# EasyEDA Pro project ProProject_Adapter_1.0.epro

# Schematic Schematic1
Create Date: 2024-11-24; Page Name: P1; Project Name: adc_commutation_pcb; Schematic Name: Schematic1; Update Date: 2025-01-06; Company: EasyEDA.com; Drawn: EasyEDA; Page Size: A4; Part Number: JLCPCB-002; Reviewed: EasyEDA; Version: V0.1
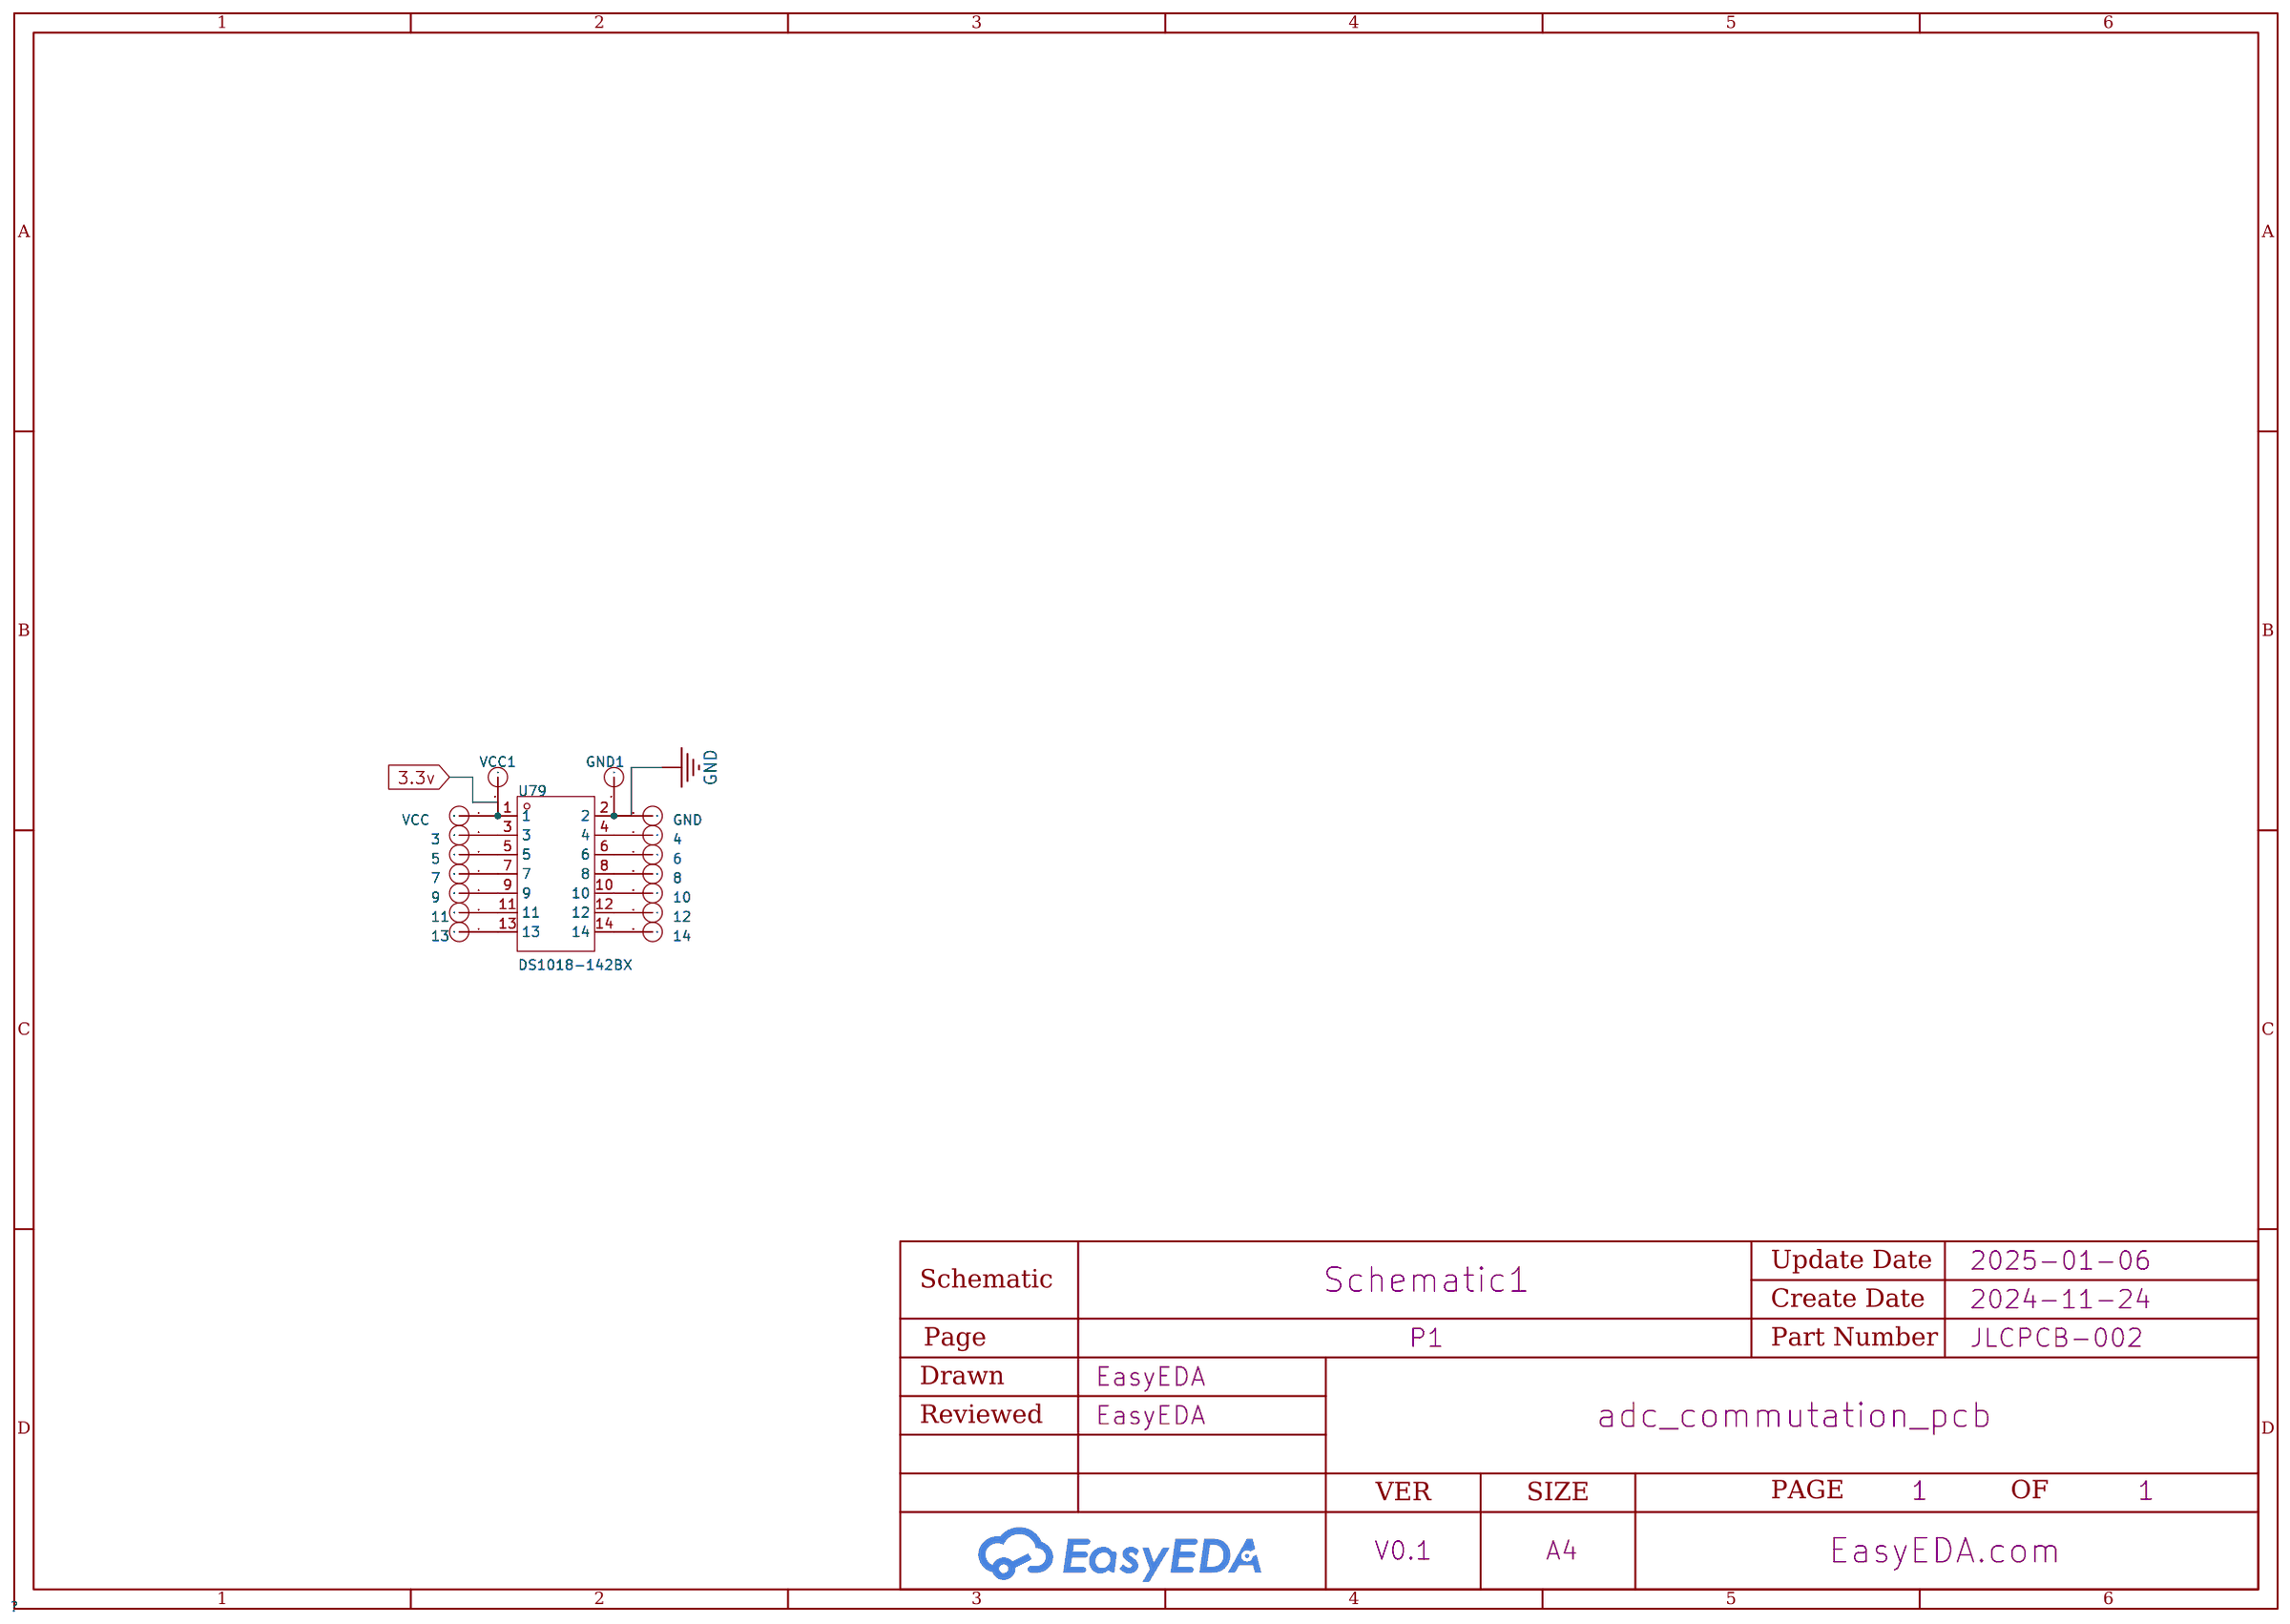
[diagram p0: schematic sheet]

## Parts
3  -  [robust_pin]
4  -  [robust_pin]
5  -  [robust_pin]
6  -  [robust_pin]
7  -  [robust_pin]
8  -  [robust_pin]
9  -  [robust_pin]
10  -  [robust_pin]
11  -  [robust_pin]
12  -  [robust_pin]
13  -  [robust_pin]
14  -  [robust_pin]
GND  -  [robust_pin]
GND1  -  [robust_pin]
U79  DS1018-142BX  [HDR-TH_14P-P2.54_CONNFLY_DS1018-142BX]
VCC  -  [robust_pin]
VCC1  -  [robust_pin]

## Library data of the parts
3-14 GND GND1 VCC VCC1 = robust_pin
U79 = DS1018-142BX: Pitch:2.54mm Structure:2x7P Number of Rows:2 Pin Number in each Row:7; LCSC Part Name: 2.54mm 2x7P 排数:2 每排P数:7; Supplier Part: C7502660; Manufacturer: CONNFLY; Supplier Footprint: 插件; JLCPCB Part Class: Extended Part; Datasheet: https://atta.szlcsc.com/upload/public/pdf/source/20230825/6018DB9854604917DD28F03647840F16.pdf; Supplier: LCSC; Pitch: 2.54mm; Structure: 2x7P; Number of Rows: 2; Pin Number in each Row: 7

## Nets
3.3v: U79.1 VCC.1 VCC1.1
GND: GND.1 GND1.1 U79.2
$1N1435: 3.1 U79.3
$1N1456: 4.1 U79.4
$1N1477: 6.1 U79.6
$1N1498: 8.1 U79.8
$1N1519: 10.1 U79.10
$1N1540: 12.1 U79.12
$1N1561: 14.1 U79.14
$1N1582: 5.1 U79.5
$1N1603: 7.1 U79.7
$1N1624: 9.1 U79.9
$1N1645: 11.1 U79.11
$1N1666: 13.1 U79.13

# Board PCB1
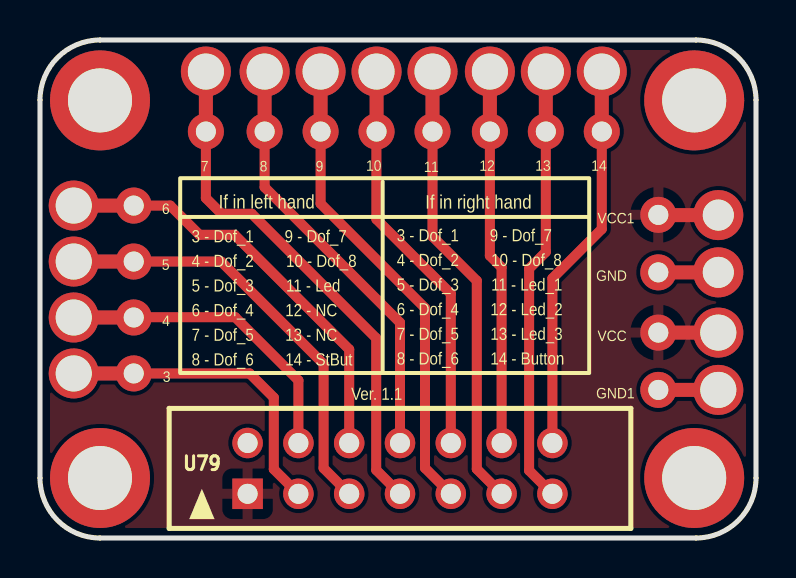
[diagram p1: board, top side]
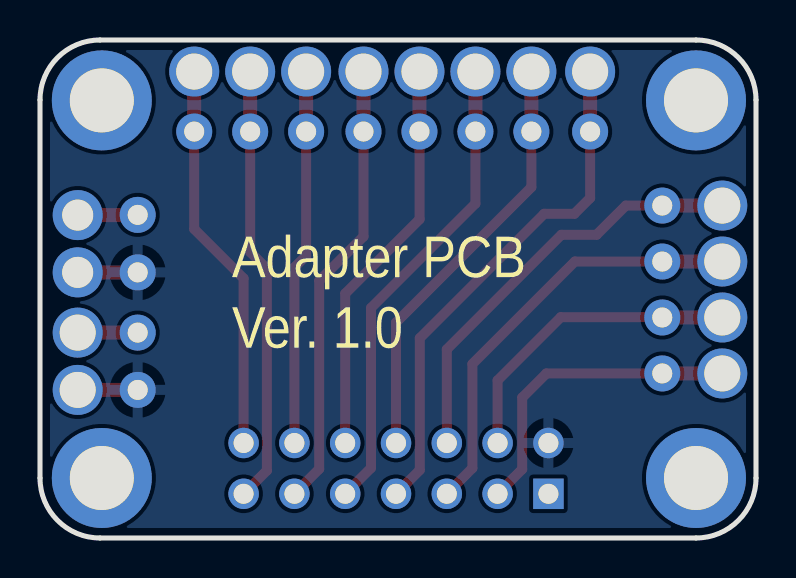
[diagram p2: board, bottom side, seen from below]

Outline 35.8 x 24.9 mm; copper layers: Top Layer, Bottom Layer. Coordinates in mm from the lower left corner of the outline.
Outline path: 0,21.9 0,3 arc(0.88,0.88) 3,0 32.8,0 arc(34.92,0.88) 35.8,3 35.8,21.9 arc(34.92,24.02) 32.8,24.9 3,24.9 arc(0.88,24.02) 0,21.9
Stack: Top Layer 0.035mm - / Dielectric1 1.51mm FR4 er 4.5 / Bottom Layer 0.035mm -

## Design rules (mm)
template: JLCPCB Capability(Two Layers Board)
spacing copperThickness1oz (default): track to track 0.102, other pairs 0.152 to 0.3
spacing copperThickness2oz: track to track 0.203, other pairs 0.152 to 0.3
track width copperThickness1oz (default): min 0.127, default 0.254, max 2.54
track width copperThickness2oz: min 0.203, default 0.254, max 2.54
differential pair differentialPair (default): width min 0.127, default 0.254, max 2.54; gap min 0.152, default 0.152
via viaSize (default): diameter min 0.5, default 0.61, max 10; hole min 0.3, default 0.305, max 6.3

## Placement (name value [footprint] x y rotation side)
3  -  [robust_pin]  4.69 8.23 90 top
4  -  [robust_pin]  4.69 11.03 90 top
5  -  [robust_pin]  4.69 13.82 90 top
6  -  [robust_pin]  4.69 16.62 90 top
7  -  [robust_pin]  8.29 20.32 0 top
8  -  [robust_pin]  11.23 20.32 0 top
9  -  [robust_pin]  14.03 20.32 0 top
10  -  [robust_pin]  16.83 20.32 0 top
11  -  [robust_pin]  19.63 20.32 0 top
12  -  [robust_pin]  22.49 20.32 0 top
13  -  [robust_pin]  25.29 20.32 0 top
14  -  [robust_pin]  28.09 20.32 0 top
GND  -  [robust_pin#2]  30.92 13.28 270 top
GND1  -  [robust_pin]  30.92 7.41 270 top
NOREF  -  [Pad_e4]  32.71 21.88 0 top
NOREF#2  -  [Pad_e78]  3 3 0 top
NOREF#3  -  [Pad_e77]  3 21.88 0 top
NOREF#4  -  [Pad_e75]  32.71 3 0 top
U79  DS1018-142BX  [hdr-th_14p-p2.54_connfly_ds1018-142bx]  18 3.48 0 top
VCC  -  [robust_pin]  30.92 10.27 270 top
VCC1  -  [robust_pin#2]  30.92 16.16 269.8 top

## Footprints (pads in the part's own frame, mm; a bottom-side part is the same pattern mirrored in y, then rotated)
hdr-th_14p-p2.54_connfly_ds1018-142bx
  rect 1.524x1.524 hole 1: 1(-7.62,-1.27)
  round 1.524 hole 1: 2(-7.62,1.27) 3(-5.08,-1.27) 4(-5.08,1.27) 5(-2.54,-1.27) 6(-2.54,1.27) 7(0,-1.27) 8(0,1.27) 9(2.54,-1.27) 10(2.54,1.27) 11(5.08,-1.27) 12(5.08,1.27) 13(7.62,-1.27) 14(7.62,1.27)
Pad_e4
  round 5 hole 3.2: 2(0,0)
Pad_e75
  round 5 hole 3.2: 2(0,0)
Pad_e77
  round 5 hole 3.2: 2(0,0)
Pad_e78
  round 5 hole 3.2: 2(0,0)
robust_pin
  round 2.5 hole 1.8x1.55: 1(0,3)
  round 1.8 hole 1: 1(0,0)
robust_pin#2
  round 2.5 hole 1.55: 1(0,3)
  round 1.8 hole 1: 1(0,0)

## Nets
As in the schematic, except:
3.3V: U79.1 VCC.1 VCC1.1

Pads without a net: NOREF 2; NOREF#2 2; NOREF#3 2; NOREF#4 2

## Routing (per net, layer and track width the routed paths; a pad name or vN(x,y) marks a point on that pad's centre or on a via; arc(x,y) is an arc through that point)
3.3V: length 6
  Top Layer w0.7: VCC1.1 30.93,16.14 VCC1.1 ; VCC.1 VCC.1
GND: length 6
  Top Layer w0.7: GND.1 GND.1 ; GND1.1 GND1.1
$1N1435: length 15.8
  Top Layer w0.5: 3.1 10.48,8.23 11.69,7.02 11.69,3.44 U79.3
  Top Layer w0.7: 3.1 3.1
$1N1456: length 15.7
  Top Layer w0.5: U79.4 12.92,7.88 9.76,11.04 4.7,11.04 4.1
  Top Layer w0.7: 4.1 4.1
$1N1477: length 21.4
  Top Layer w0.5: 6.1 6.51,16.62 7.97,15.16 9.73,15.16 15.46,9.43 U79.6
  Top Layer w0.7: 6.1 6.1
$1N1498: length 21.4
  Top Layer w0.5: U79.8 18,10.77 11.23,17.54 8.1
  Top Layer w0.7: 8.1 8.1
$1N1519: length 20.1
  Top Layer w0.5: U79.10 20.54,12.22 16.82,15.94 16.82,20.31 10.1
  Top Layer w0.7: 10.1 10.1
$1N1540: length 18.8
  Top Layer w0.5: 12.1 22.49,14.12 23.08,13.53 U79.12
  Top Layer w0.7: 12.1 12.1
$1N1561: length 19.6
  Top Layer w0.5: 14.1 28.09,15.45 25.62,12.98 U79.14
  Top Layer w0.7: 14.1 14.1
$1N1582: length 21.6
  Top Layer w0.5: 5.1 9.06,13.82 14.18,8.7 14.18,3.49 U79.5
  Top Layer w0.7: 5.1 5.1
$1N1603: length 26
  Top Layer w0.5: U79.7 16.81,3.4 16.81,9.99 10.59,16.21 9.08,16.21 8.29,17 7.1
  Top Layer w0.7: 7.1 7.1
$1N1624: length 23.8
  Top Layer w0.5: U79.9 19.25,3.5 19.25,11.5 14.03,16.72 9.1
  Top Layer w0.7: 9.1 9.1
$1N1645: length 22.5
  Top Layer w0.5: 11.1 19.63,15.07 21.84,12.86 21.84,3.45 U79.11
  Top Layer w0.7: 11.1 11.1
$1N1666: length 21.9
  Top Layer w0.5: U79.13 24.46,3.37 24.46,13.47 25.29,14.3 13.1
  Top Layer w0.7: 13.1 13.1

## Copper pours and planes (outline as drawn; the poured copper is in the pictures)
3.3V on Top Layer: 0,24.98 36.04,24.98 36.04,0 0,0
GND on Bottom Layer: 0.26,25.14 35.96,25.14 35.96,0 0.26,0

## Text on the board
Bottom Silkscreen Layer: Adapter PCB / Ver. 1.0
Top Silkscreen Layer: 3 - Dof_1 | 4 - Dof_2 | 5 - Dof_3 | 6 - Dof_4 | 7 - Dof_5 | 8 - Dof_6 | 9 - Dof_7 | 12 - NC | 13 - NC | 14 - StBut | 10 - Dof_8 | 11 - Led | Ver. 1.1 | 12 - Led_2 | 13 - Led_3 | 14 - Button | 11 - Led_1 | If in left hand | If in right hand
